# Altium schematic sheet USBdevice.SchDoc
size A4
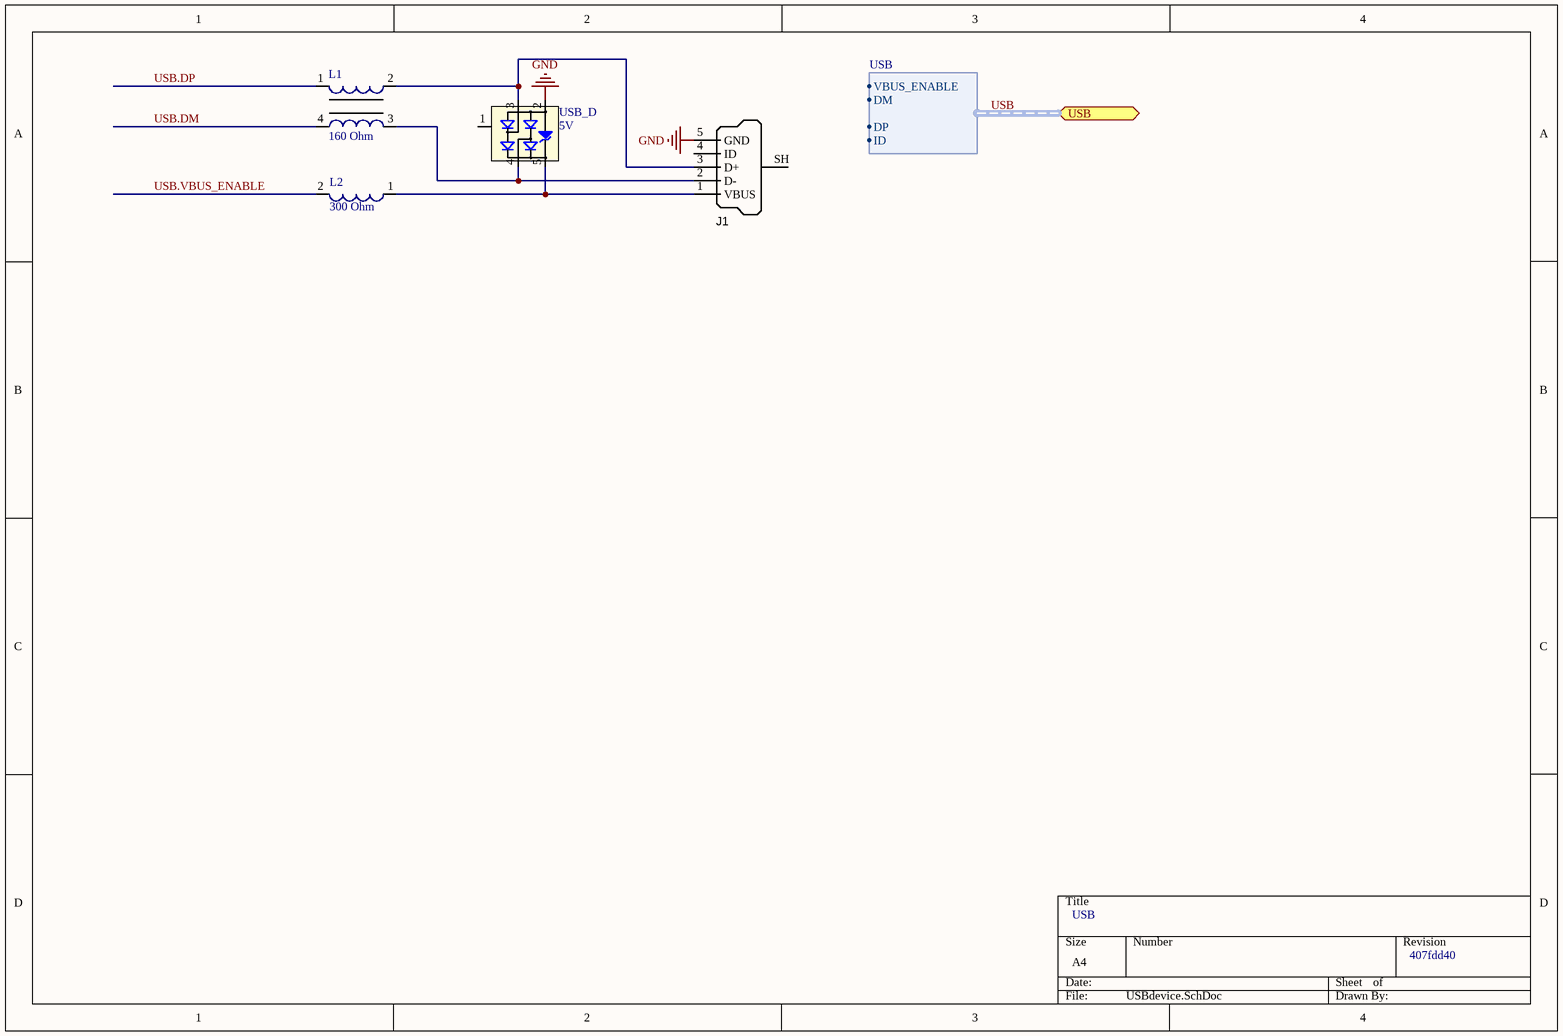
[diagram p0: USBdevice.SchDoc]

## Parts
J1  USB Micro Type B  [USB_Micro-B_FCI_SMD]  (value not drawn)
L1  160 Ohm  [WE-CNSW, 1206]
L2  300 Ohm  [SMD 0603]
USB_D  5V  [SOT23_5L]

## Ports
USB (harness USB)

## Harnesses
USB: VBUS_ENABLE, DM, DP, ID

## Nets
GND: J1.5(GND) USB_D.2(GND)
USB.DM: L1.4
USB.DP: L1.1
USB.VBUS_ENABLE: L2.2
NetJ1_1: J1.1(VBUS) L2.1 USB_D.5(VDD)
NetJ1_2: J1.2(D-) L1.3 USB_D.4(I/O2)
NetJ1_3: J1.3(D+) L1.2 USB_D.3(I/O1)

Not connected (* = marked no-connect by the designer): J1 4(ID) SH(Shell); USB_D 1(NC)

## Buses and harness runs
harness USB = port USB

## Notes on the sheet
- USB
- 407fdd40

## Library data of the parts
J1 = USB_Micro_TypeB_FCI: Connector SMD-THD USB Micro Type B middle mount; Manufacturer 1: FCI; Manufacturer Part Number 1: 10103593-0001LF; Package / Case: SMD/THD mid-mount; Supplier 1: Digi-Key; Supplier Part Number 1: 609-4049-1-ND
L1 = WE-CNSW 1206, 744232161: SMD Common Mode Noise Suppressor WE-CNSW,  Z= 160 Ohm; Manufacturer: Würth Elektronik eiSos GmbH; partNo: 744232161; Impedance: 160 Ohm; ComponentLink1Description: Manufacturer; ComponentLink1URL: http://www.we-online.de; Created by: Christin Zierenner; Created Date: November 2009; ComponentLink2Description: Datasheet; ComponentLink2URL: http://www.we-online.de/katalog/media/pdf/744232161.pdf
L2 = WE-CBF 0603, 742792641: SMD EMI Suppression Ferrite Beads WE-CBF, Z= 300 Ohm; Manufacturer: Würth Elektronik eiSos GmbH; partNo: 742792641; Impedance: 300 Ohm; ComponentLink1Description: Manufacturer; ComponentLink1URL: http://www.we-online.de; Created by: Christin Zierenner; Created Date: May 2009; ComponentLink2Description: Datasheet; ComponentLink2URL: http://www.we-online.de/katalog/media/pdf/742792641.pdf
USB_D = WE-TVS-HS,SOT23-5L,824011: TVS Diode WE-TVS-HS, VRWM=5V; PartNo: 824011; Manufacturer: Würth Elektronik eiSos GmbH; Reverse Stand Off Voltage: 5V; ComponentLink1Description: Manufacturer; ComponentLink1URL: http://www.we-online.de; Created by: Christin Zierenner; Created Date: March 2010; ComponentLink2Description: Datasheet; ComponentLink2URL: http://katalog.we-online.de/kataloge/eisos/media/pdf/824011.pdf